# Altium schematic sheet PDS_JSTConnections.SchDoc
size A; SheetNumber: 2; SheetTotal: 2
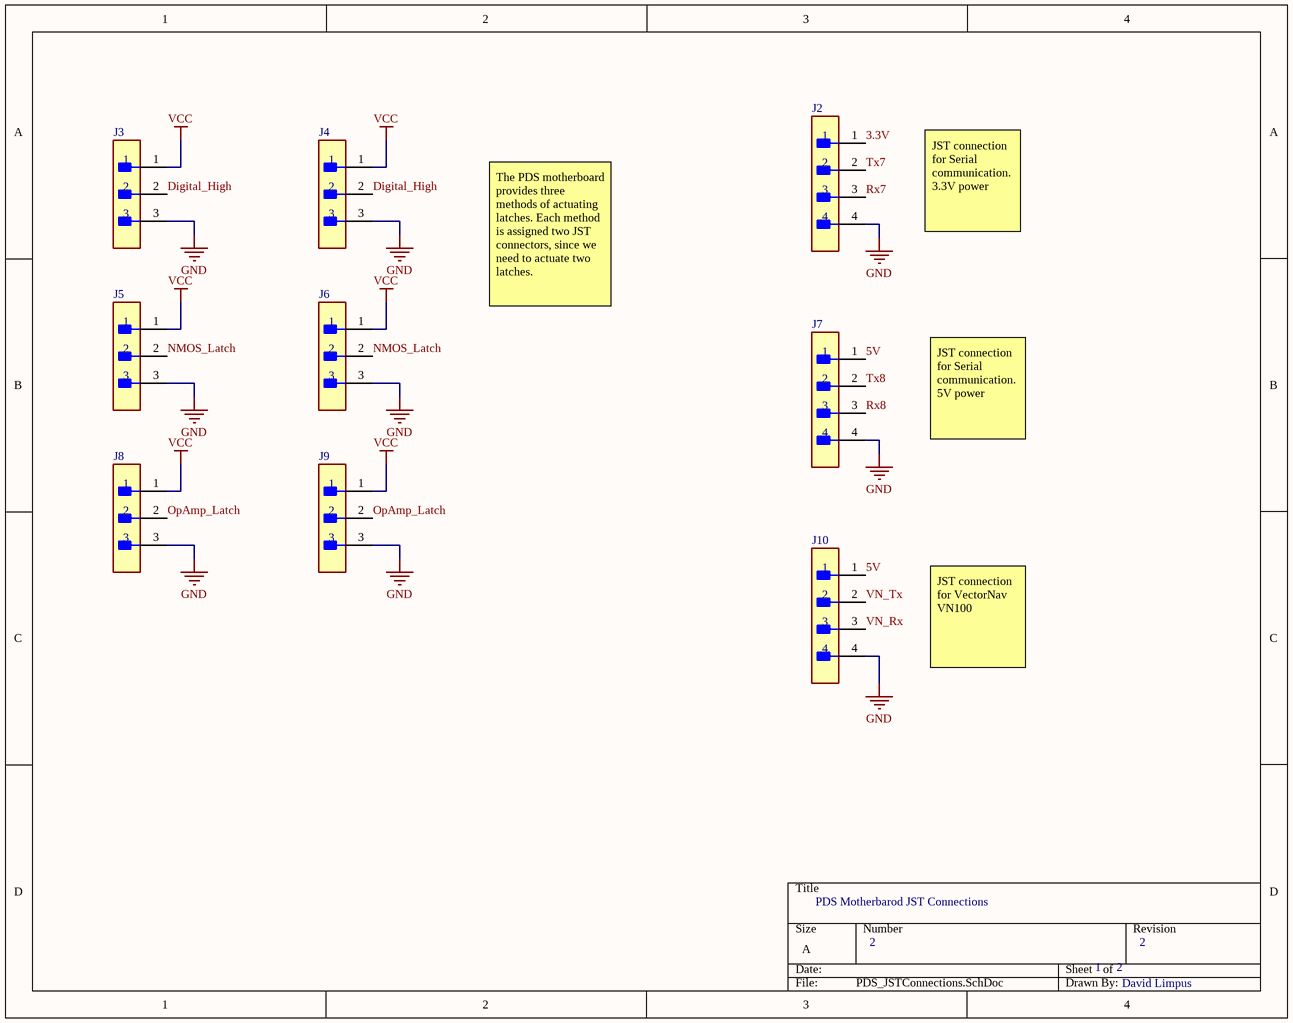
[diagram p0: PDS_JSTConnections.SchDoc]

## Parts
J2  B04B-XASK-1-A(LF)(SN)  [FP-B04B-XASK-1-A_LF_SN-MFG]  (value not drawn)
J3  B03B-XASK-1-A(LF)(SN)  [FP-B03B-XASK-1-A_LF_SN-MFG]  (value not drawn)
J4  B03B-XASK-1-A(LF)(SN)  [FP-B03B-XASK-1-A_LF_SN-MFG]  (value not drawn)
J5  B03B-XASK-1-A(LF)(SN)  [FP-B03B-XASK-1-A_LF_SN-MFG]  (value not drawn)
J6  B03B-XASK-1-A(LF)(SN)  [FP-B03B-XASK-1-A_LF_SN-MFG]  (value not drawn)
J7  B04B-XASK-1-A(LF)(SN)  [FP-B04B-XASK-1-A_LF_SN-MFG]  (value not drawn)
J8  B03B-XASK-1-A(LF)(SN)  [FP-B03B-XASK-1-A_LF_SN-MFG]  (value not drawn)
J9  B03B-XASK-1-A(LF)(SN)  [FP-B03B-XASK-1-A_LF_SN-MFG]  (value not drawn)
J10  B04B-XASK-1-A(LF)(SN)  [FP-B04B-XASK-1-A_LF_SN-MFG]  (value not drawn)

## Nets
GND: J2.4 J3.3 J4.3 J5.3 J6.3 J7.4 J8.3 J9.3 J10.4
VCC: J3.1 J4.1 J5.1 J6.1 J8.1 J9.1
3.3V: J2.1
5V: J7.1 J10.1
Digital_High: J3.2 J4.2
NMOS_Latch: J5.2 J6.2
OpAmp_Latch: J8.2 J9.2
Rx7: J2.3
Rx8: J7.3
Tx7: J2.2
Tx8: J7.2
VN_Rx: J10.3
VN_Tx: J10.2

## Notes on the sheet
- JST connection for Serial communication. 3.3V power
- The PDS motherboard provides three methods of actuating latches. Each method is assigned two JST connectors, since we need to actuate two latches.
- JST connection for Serial communication. 5V power
- JST connection for VectorNav VN100
- PDS Motherbarod JST Connections
- 2
- 1
- David Limpus

## Library data of the parts
J2 J7 J10 = CMP-2000-05878-2: CONN HEADER VERT POS 2.5MM; Number of Positions: 4; Mated Stacking Heights: 11.3mm; Voltage Rating: 250V; Lead Free: Lead Free; Series: XA; Flammability Rating: UL94 V-0; Contact Shape: Circular; Packaging: Bulk; Connector Type: Header; Insulation Color: Natural; Termination: Press-Fit; Contact Type: Male Pin; Pitch: 2.5mm; Insulation Material: Nylon; Contact Material: Copper Alloy; Fastening Type: Ramp; Mount: Through Hole; Number of Rows: 1; Contact Finish - Mating: TIN
J3-J6 J8 J9 = CMP-17439-000540-1: CONN HEADER VERT 3POS 2.5MM; Number of Positions: 3; Voltage Rating: 250V; Mated Stacking Heights: 11.3mm; Contact Shape: Circular; Pitch: 2.5mm; Lead Free: Lead Free; Connector Type: Header; Flammability Rating: UL94 V-0; Contact Material: Copper Alloy; Packaging: Bulk; Insulation Color: Natural; Fastening Type: Ramp; Contact Type: Male Pin; Series: XA; Termination: Press-Fit; Contact Finish - Mating: TIN; Insulation Material: Nylon; Number of Rows: 1; Mount: Through Hole